# EAGLE design PIR AM612 pro hodiny (EAGLE 9.6.2)
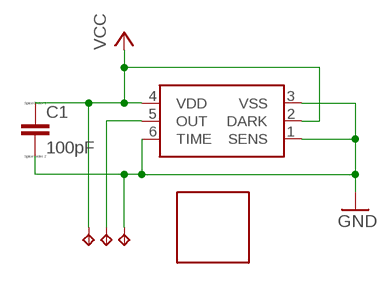
[diagram p0: schematic, sheet 1]

## Parts
C1  100pF  CC0603  [C0603]
TP1  TPB1,27  [B1,27]
TP2  TPB1,27  [B1,27]
TP3  TPB1,27  [B1,27]
U$1  AM612  [TO5]
U$2  LOGO_VOKOLO7,5MM  [LOGO_VOKOLO_6,2MM]

## Nets
GND: C1.2 TP3.TP U$1.1(SENS) U$1.3(VSS) U$1.6(TIME)
N$1: TP2.TP U$1.5(OUT)
VCC: C1.1 TP1.TP U$1.2(DARK) U$1.4(VDD)

## Library data of the parts
C1 = eagle-ltspice:C: CAPACITOR, European symbol; SPICEMODEL: NONE; SPICEPREFIX: C
TP1-TP3 = testpad:TP: Test pad
U$1 = AM612:AM612
U$2 = logo_vokolo:LOGO_VOKOLO: logo vokolo

## Board
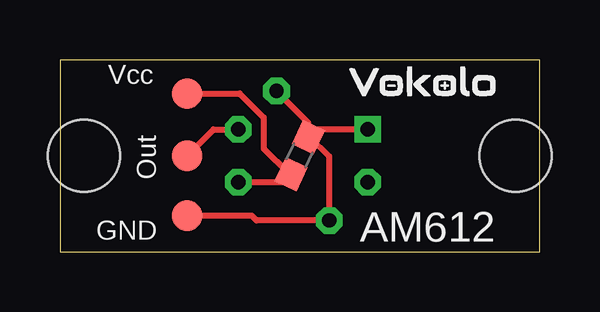
[diagram p1: board, top side]
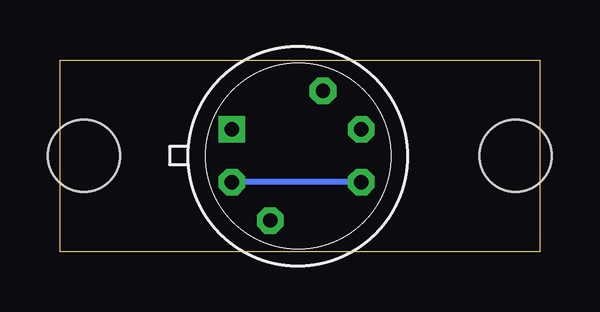
[diagram p2: board, bottom side, seen from below]

Size 20 x 8 mm. Coordinates in mm from the lower left corner, seen from the top.
Outline: 0,0 20,0 20,8 0,8 0,0
Copper layers (1*16): Top 0.035mm / dielectric 1.5mm / Bottom 0.035mm
Design rules "default": minimum track width 6mil, minimum drill 0.3mm, track to track 6mil, track to pad 6mil, pad to pad 6mil, via to via 6mil, smd to smd 6mil, copper to edge 20mil, drill to drill 6mil, minimum pad ring 10mil, minimum via ring 8mil, stop-mask expansion 4mil, vias tented up to drill 0.3mm, thermal gap 12mil
Holes 3 mm at 1,4 19,4

### Footprints (pad centres in the part's own frame; a part is rotated, then mirrored left to right if it is on the bottom)
C0603 = smd 1.1 x 1: 1 -0.85,0; 2 0.85,0
B1,27 = smd 1.27 x 1.27: TP 0,0
TO5 = drill 0.6 square: 1 2.83,-1.1 | drill 0.6 octagon: 2 2.83,1.1; 3 1.23,2.7; 4 -2.57,1.1; 5 -2.57,-1.1; 6 -0.97,-2.7

### Placement (x,y rotation side)
C1  10,4 65 top
TP1  5.3,6.6 0 top
TP2  5.3,4 0 top
TP3  5.3,1.5 0 top
U$1  10,4 180 bottom
U$2  12,6.5 0 top

### Tracks (layer width: path | path; a pad name or v marks a point on that pad's centre or on a via)
GND
  Top 0.254: TP3.TP 8,1.5 8.2,1.3 U$1.3 11.23,3.97 10.43,4.77 | 10.43,4.77 C1.2 10.36,5.37 U$1.6 | U$1.1 10.76,5.1 10.43,4.77
N$1
  Top 0.254: TP2.TP 6.4,5.1 U$1.5
VCC
  Top 0.254: TP1.TP 7.5,6.6 8.5,5.6 8.5,4.3 9.57,3.23 C1.1 9.31,2.9 U$1.4
  Bottom 0.254: U$1.4 U$1.2

### Text on the board
tNames: Vcc | Out | GND | AM612